# EAGLE design ai_aerea (EAGLE 6.5.0)
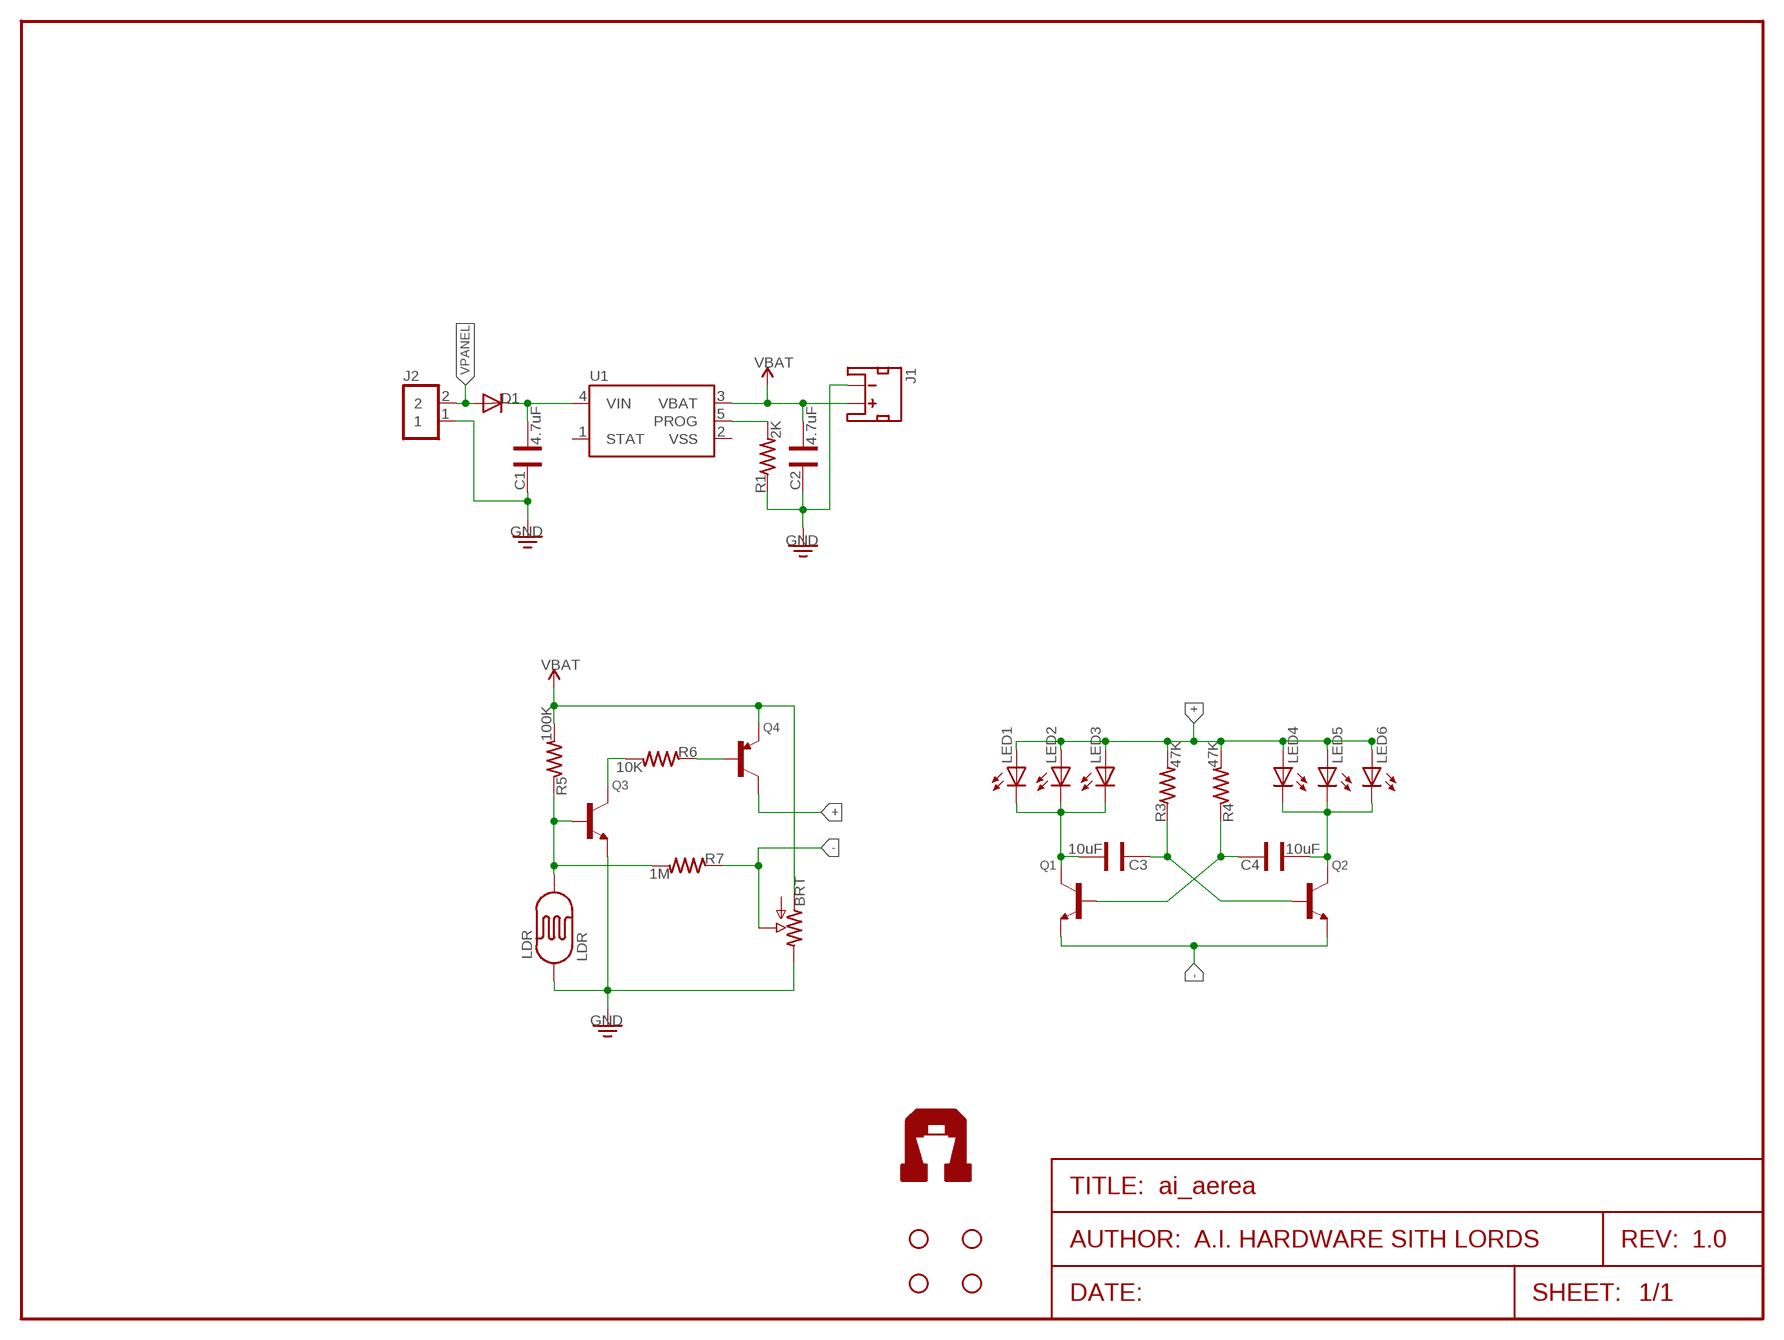
[diagram p0: schematic, sheet 1]
FRAME1 (FRAME-LETTER): AUTHOR: A.I. HARDWARE SITH LORDS; REV: 1.0

## Parts
BRT  POT05X05  [POT-05X05]
C1  4.7uF  CAP025X050  [CAP-025X050]
C2  4.7uF  CAP025X050  [CAP-025X050]
C3  10uF  CAP025X050  [CAP-025X050]
C4  10uF  CAP025X050  [CAP-025X050]
D1  DIODETH-1N914  [TH-1N914]
J1  JST-2-MALE  [JST-2-SMD]
J2  1X02ST  [1X02-ST]
LDR  LDR-PTH  [LDR]
LED1  LED5MM  [LED-5MM]
LED2  LED5MM  [LED-5MM]
LED3  LED5MM  [LED-5MM]
LED4  LED5MM  [LED-5MM]
LED5  LED5MM  [LED-5MM]
LED6  LED5MM  [LED-5MM]
Q1  TRANSISTOR-NPN  [TO-92-NPN]
Q2  TRANSISTOR-NPN  [TO-92-NPN]
Q3  TRANSISTOR-NPN  [TO-92-NPN]
Q4  TRANSISTOR-PNP  [TO-92-PNP]
R1  2K  RESAXIAL-0.4  [RES-AXIAL-0.4]
R3  47K  RESAXIAL-0.4  [RES-AXIAL-0.4]
R4  47K  RESAXIAL-0.4  [RES-AXIAL-0.4]
R5  100K  RESAXIAL-0.4  [RES-AXIAL-0.4]
R6  10K  RESAXIAL-0.4  [RES-AXIAL-0.4]
R7  1M  RESAXIAL-0.4  [RES-AXIAL-0.4]
STANDOFF1  STAND-OFF  [STAND-OFF]
STANDOFF2  STAND-OFF  [STAND-OFF]
STANDOFF3  STAND-OFF  [STAND-OFF]
STANDOFF4  STAND-OFF  [STAND-OFF]
U1  MCP73831  [SOT23-5]
U$4  AI-LOGOM  [AI-LOGO-M]

## Nets
+: LED1.A LED2.A LED3.A LED4.A LED5.A LED6.A Q4.1(C) R3.P$2 R4.P$2
-: BRT.2(S) Q1.1(E) Q2.1(E) R7.P$1
GND: BRT.1(E) C1.2 C2.2 J1.2(-) J2.1 LDR.1 Q3.1(E) R1.P$1
N$2: C1.1 D1.C U1.4(VIN)
N$3: R1.P$2 U1.5(PROG)
N$6: C3.2 Q2.2(B) R3.P$1
N$7: C4.2 Q1.2(B) R4.P$1
N$9: C4.1 LED4.C LED5.C LED6.C Q2.3(C)
N$10: LDR.2 Q3.2(B) R5.P$1 R7.P$2
N$12: Q3.3(C) R6.P$2
N$13: Q4.2(B) R6.P$1
N$14: C3.1 LED1.C LED2.C LED3.C Q1.3(C)
VBAT: BRT.3(A) C2.1 J1.1(+) Q4.3(E) R5.P$2 U1.3(VBAT)
VPANEL: D1.A J2.2
Unconnected: U1.1(STAT)

## Power pins joined to a net without a drawn wire
VSS: U1.2(VSS)

## Library data of the parts
BRT = Ai_Passives:POT
C1-C4 = Ai_Passives:CAP
D1 = Ai_DiscreteSemis:DIODE
J1 = Ai_Connectors:JST-2-MALE
J2 = Ai_Connectors:1X02
LDR = Ai_Sensors:LDR
LED1-LED6 = Ai_LED:LED
Q1-Q3 = Ai_DiscreteSemis:TRANSISTOR-NPN
Q4 = Ai_DiscreteSemis:TRANSISTOR-PNP
R1 R3-R7 = Ai_Passives:RES: Part # blah Digikey
STANDOFF1-STANDOFF4 = Ai_Electromechanical:STAND-OFF: #4 Stand Off This is the mechanical footprint for a #4 phillips button head screw. Use the keepout ring to avoid running the screw head into surrounding components.
U1 = Ai_IC:MCP73831; PROD_ID: IC-09995
U$4 = Ai_Miscellany:AI-LOGO

## Board
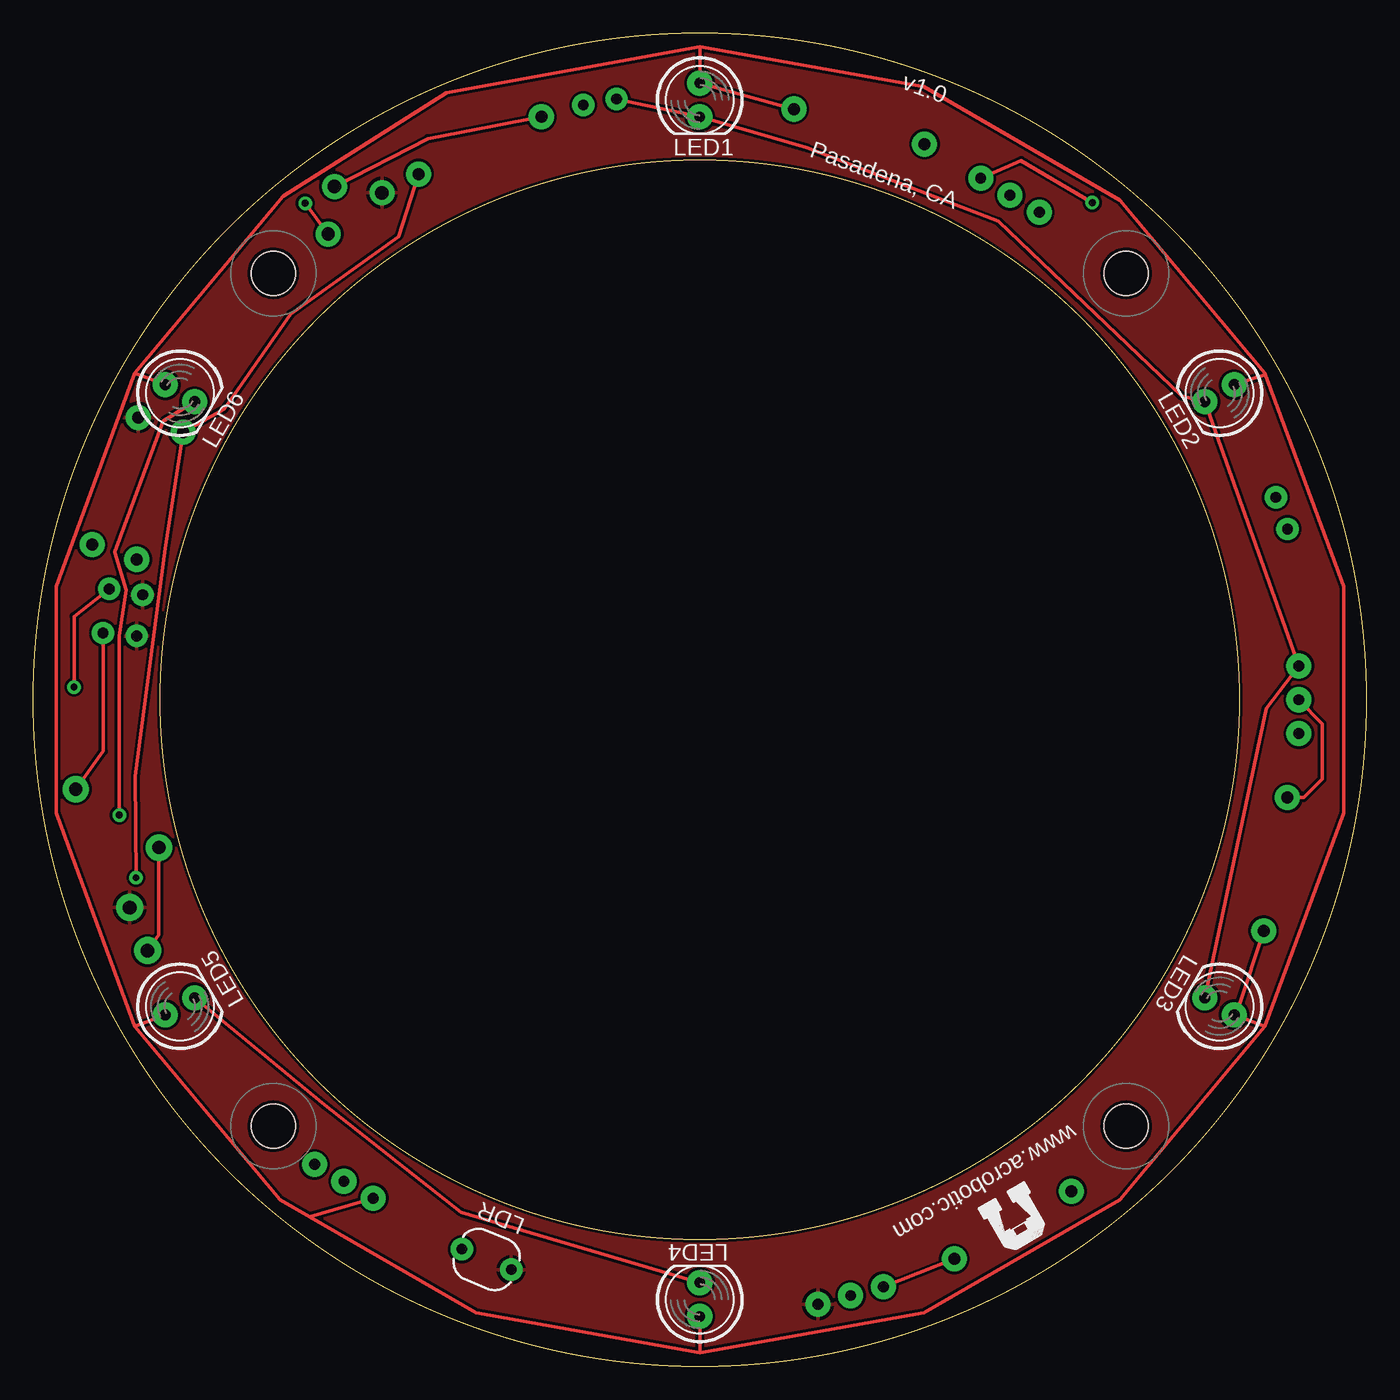
[diagram p1: board, top side]
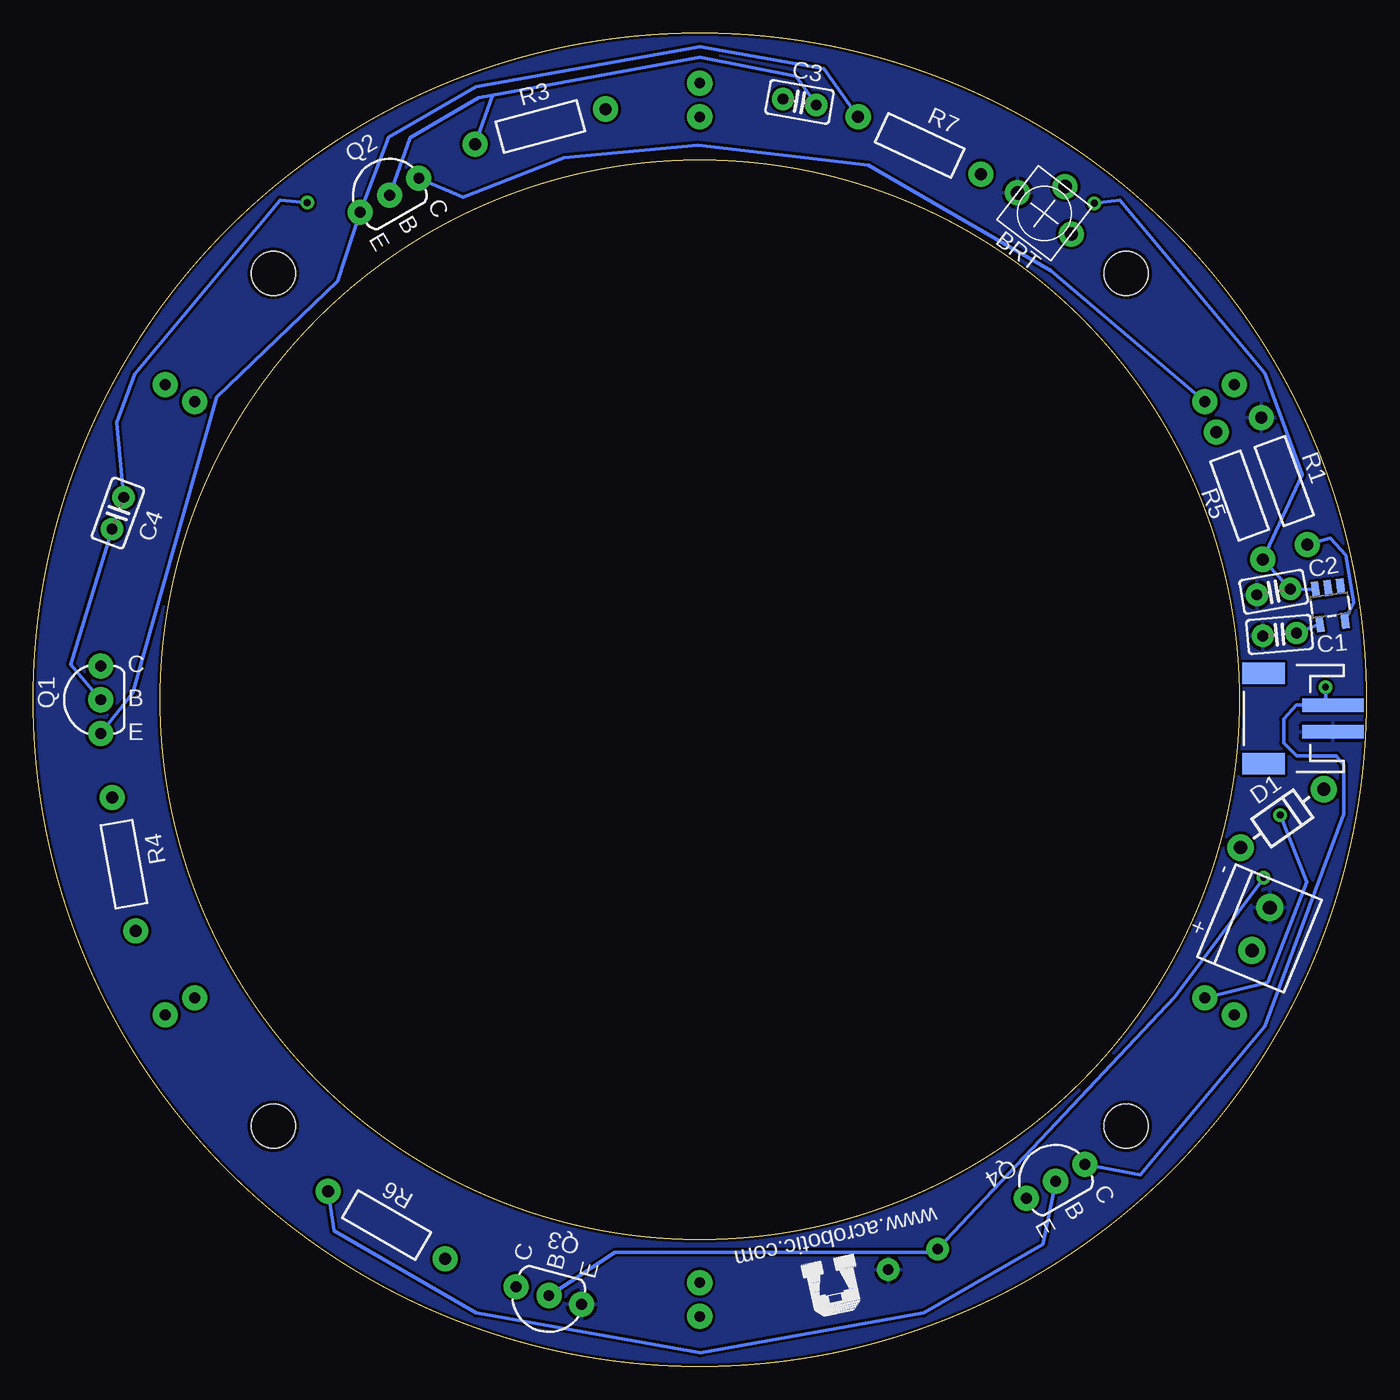
[diagram p2: board, bottom side, seen from below]

Size 100 x 100 mm. Coordinates in mm from the lower left corner, seen from the top.
Outline: circle at 50,50 radius 40.5
Outline: circle at 50,50 radius 50
Copper layers (1*16): Top 0.035mm / dielectric 1.5mm / Bottom 0.035mm
Design rules "ai_2layer": minimum track width 7mil, minimum drill 15mil, track to track 8mil, track to pad 8mil, pad to pad 8mil, via to via 8mil, smd to smd 8mil, copper to edge 8mil, drill to drill 8mil, minimum pad ring 12mil, minimum via ring 10mil, stop-mask expansion 4mil, vias tented up to drill 20mil, thermal gap 10mil

### Footprints (pad centres in the part's own frame; a part is rotated, then mirrored left to right if it is on the bottom)
POT-05X05 = drill 1 pad 1.88: 1 -2.54,0; 2 0,2.54; 3 2.54,0
CAP-025X050 = drill 0.813 pad 1.676: 1 -1.27,0; 2 1.27,0
TH-1N914 = drill 1 pad 1.981: A -3.81,0; C 3.81,0
JST-2-SMD = smd 1 x 4.6: 1 1,-3.7; 2 -1,-3.7 | smd 1.6 x 3.2: NC1 -3.4,1.5; NC2 3.4,1.5
1X02-ST = drill 1.016 pad 2.032: 1 -1.75,0; 2 1.75,0
LDR = drill 0.8 pad 1.676: 1 -2,0; 2 2,0
LED-5MM = drill 0.813 pad 1.88: A -1.27,0; C 1.27,0
TO-92-NPN = drill 0.813 pad 1.88: 1 0,-2.54; 2 0,0; 3 0,2.54
TO-92-PNP = drill 0.813 pad 1.88: 1 0,2.54; 2 0,0; 3 0,-2.54
RES-AXIAL-0.4 = drill 0.9 pad 1.88: P$1 -5.08,0; P$2 5.08,0
STAND-OFF = hole 3.302: 0,0
SOT23-5 = smd 0.55 x 1.2: 1 -0.95,-1.3; 2 0,-1.3; 3 0.95,-1.3; 4 0.95,1.3; 5 -0.95,1.3

### Placement (x,y rotation side)
BRT  24.14,86.49 322.5 bottom
C1  6.5,54.9 185 bottom
C2  6.95,58.09 190 bottom
C3  42.51,94.85 350 bottom
C4  93.66,64 250 bottom
D1  6.3,41.1 35 bottom
J1  6.2,48.6 90 bottom
J2  7.9,32.8 247.5 bottom
LDR  34.01,8.01 157.5 top
LED1  50,95 270 top
LED2  89,73 210 top
LED3  89,27 150 top
LED4  50,5 90 top
LED5  11,27 30 top
LED6  11,73 330 top
Q1  94.95,50 0 bottom
Q2  73.28,87.85 300 bottom
Q3  61.32,5.3 75 bottom
Q4  23.3,13.87 120 bottom
R1  6.14,66.41 290 bottom
R3  61.96,93.01 15 bottom
R4  93.2,37.66 280 bottom
R5  9.5,65.31 290 bottom
R6  73.49,10.58 330 bottom
R7  33.51,91.59 335 bottom
STANDOFF1  18,18 0 top
STANDOFF2  82,82 0 top
STANDOFF3  18,82 0 top
STANDOFF4  82,18 0 top
U1  2.7,57.1 187.5 bottom
U$3  AI-LOGOM  [AI-LOGO-M]  74.39,14.03 210 top
U$4  38.39,8.58 192.5 bottom

### Tracks (layer width: path | path; a pad name or v marks a point on that pad's centre or on a via)
+
  Top 0.254: R4.P$2 90.45,27 LED3.A 92.4,25.5 | 50,99 31,95.55 18.75,87.8 7.6,74.5 | 50,99 66.8,96 81.5,87.5 92.4,74.5 92.43,74.41 | 92.43,74.41 98.3,58.5 98.3,41.5 92.4,25.5 | 92.4,25.5 81.5,12.5 66.8,4 50,1 | 50,1 33.2,4 20.72,11.22 | 20.72,11.22 18.5,12.5 7.6,25.5 | 7.6,25.5 1.7,41.5 1.7,58.5 7.6,74.5 | 50,99 LED1.A R3.P$2 | LED2.A 92.43,74.41 | 50,1 LED4.A | 7.6,25.5 LED5.A | 7.6,74.5 LED6.A | Q4.1 20.72,11.22
-
  Top 0.254: BRT.2 29.6,92.1 R7.P$1
  Bottom 0.254: R7.P$1 40.7,97.35 50,99 66.8,96 73.35,92.2 Q2.1 77.15,81.4 86.25,72.7 92.55,50.5 Q1.1
GND
  pour Bottom: 0,0 0,100 100,100 100,0
  pour Top: 0,0 0,100 100,100 100,0
N$2
  Top 0.254: D1.C 5.25,46.15 C1.1
  Bottom 0.254: C1.1 U1.4
N$3
  Bottom 0.254: U1.5 0.95,57.3 1.55,60.85 2.7,62.15 R1.P$2
N$6
  Bottom 0.254: Q2.2 71.75,92.15 66.6,95.15 65.53,95.36 | 65.53,95.36 50,98.2 42.8,96.8 C3.2 | R3.P$1 65.53,95.36
N$7
  Top 0.254: Q1.2 96.7,48.2 96.7,44.05 95.31,42.66 R4.P$1
  Bottom 0.254: Q1.2 97.2,52.65 C4.2
N$9  (via drill 0.51)
  Top 0.254: v79.45,87.3 74.1,90.45 Q2.3 | v6.45,41.35 6.45,54.8 6.95,58.25 6.1,61.1 9.75,70.9 LED6.C | LED5.C 21.85,19.6 32.1,11.55 LED4.C
  Bottom 0.254: LED6.C 23.65,82.2 37.35,90.1 50.15,91.6 60.2,90.65 67.75,87.7 Q2.3 | C4.1 93.75,70.8 92.4,74.45 81.5,87.5 v79.45,87.3 | LED5.C 7.4,28.8 4.45,36.35 v6.45,41.35
N$10  (via drill 0.51)
  Top 0.254: R7.P$2 27.4,84.75 19.3,78.95 14.3,71.8 R5.P$1 9.9,61.35 7.65,44.3 v7.7,36.65
  Bottom 0.254: Q3.2 56.35,8.55 32.55,8.55 LDR.2 14.35,27.7 v7.7,36.65
N$12
  Top 0.254: Q3.3 R6.P$2
N$13
  Bottom 0.254: Q4.2 24.25,9.15 33.2,4 49.95,1 66.8,4 77.45,10.15 R6.P$1
N$14
  Top 0.254: LED3.C 92.5,49.35 Q1.3 LED2.C 86.15,72.8 72.4,85.9 58.05,91.4 LED1.C C3.1
VBAT  (via drill 0.51)
  Top 0.254: BRT.3 v20.4,87.25 | C2.1 3.05,56.25 v3.05,50.95
  Bottom 0.254: U1.3 C2.1 R5.P$2 4.8,66.9 7.6,74.5 18.5,87.5 v20.4,87.25 | Q4.3 16.95,14.35 7.6,25.5 1.7,41.45 1.7,45.1 2.25,45.8 5.2,45.8 6.2,46.75 6.2,48.55 5.25,49.6 3.05,49.6 | J1.1 3.05,49.6 | v3.05,50.95 3.05,49.6
VPANEL
  Top 0.254: D1.A 9.4,32.35 J2.2

### Text on the board
tNames: v1.0 | Pasadena, CA | www.acrobotic.com
bNames: - | + | www.acrobotic.com